# EAGLE design tripleir (EAGLE 6.6.0)
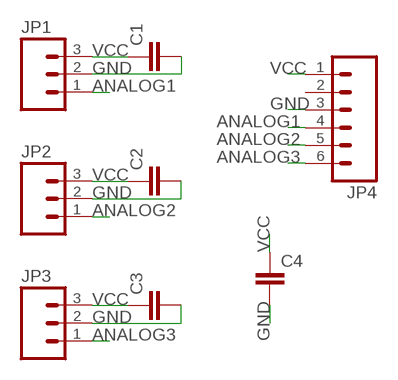
[diagram p0: schematic, sheet 1]

## Parts
C1  CAP0603-CAP  [0603-CAP]
C2  CAP0603-CAP  [0603-CAP]
C3  CAP0603-CAP  [0603-CAP]
C4  CAP0603-CAP  [0603-CAP]
JP1  M03LONGPADS  [1X03_LONGPADS]
JP2  M03LONGPADS  [1X03_LONGPADS]
JP3  M03LONGPADS  [1X03_LONGPADS]
JP4  M06SIP  [1X06]

## Nets
ANALOG1: JP1.1 JP4.4
ANALOG2: JP2.1 JP4.5
ANALOG3: JP3.1 JP4.6
GND: C1.2 C2.2 C3.2 C4.2 JP1.2 JP2.2 JP3.2 JP4.3
VCC: C1.1 C2.1 C3.1 C4.1 JP1.3 JP2.3 JP3.3 JP4.1
Unconnected: JP4.2

## Library data of the parts
C1-C4 = SparkFun-Capacitors:CAP: Capacitor Standard 0603 ceramic capacitor, and 0.1" leaded capacitor.
JP1-JP3 = SparkFun-Connectors:M03: Header 3 Standard 3-pin 0.1" header. Use with straight break away headers (SKU : PRT-00116), right angle break away headers (PRT-00553), swiss pins (PRT-00743), machine pins (PRT-00117), and female headers (PRT-00115). Molex polarized connector foot print use with SKU : PRT-08232 with associated crimp pins and housings.
JP4 = SparkFun-Connectors:M06: Header 6 Standard 6-pin 0.1" header. Use with straight break away headers (SKU : PRT-00116), right angle break away headers (PRT-00553), swiss pins (PRT-00743), machine pins (PRT-00117), and female headers (PRT-00115). Molex polarized connector foot print use with SKU : PRT-08094 with associated crimp pins and housings. NOTES ON THE VARIANTS LOCK and LOCK_LONGPADS... This footprint was designed to help hold the alignment of a through-hole component (i.e. 6-pin header) while soldering it into place. You may notice that each hole has been shifted either up or down by 0.005 of an inch from it's more standard position (which is a perfectly straight line). This slight alteration caused the pins (the squares in the middle) to touch the edges of the holes. Because they are alternating, it causes a "brace" to hold the component in place. 0.005 has proven to be the perfect amount of "off-center" position when using our standard breakaway headers. Although looks a little odd when you look at the bare footprint, once you have a header in there, the alteration is very hard to notice. Also,if you push a header all the way into place, it is covered up entirely on the bottom side. This idea of altering the position of holes to aid alignment will be further integrated into the Sparkfun Library for other footprints. It can help hold any component with 3 or more connection pins.

## Board
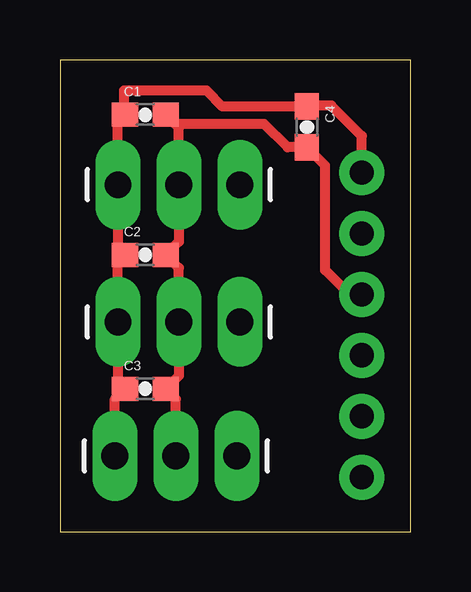
[diagram p1: board, top side]
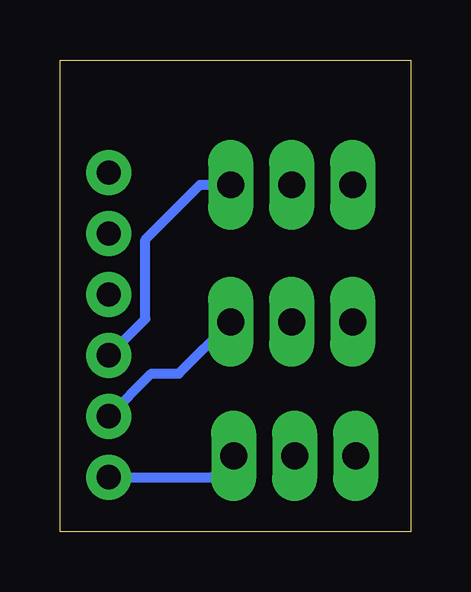
[diagram p2: board, bottom side, seen from below]

Size 14.61 x 19.68 mm. Coordinates in mm from the lower left corner, seen from the top.
Outline: 0,0 14.61,0 14.61,19.68 0,19.68 0,0
Copper layers (1*16): Top 0.035mm / dielectric 1.5mm / Bottom 0.035mm
Design rules "default": minimum track width 10mil, minimum drill 24mil, track to track 8mil, track to pad 8mil, pad to pad 8mil, via to via 8mil, smd to smd 8mil, copper to edge 40mil, drill to drill 8mil, minimum pad ring 10mil, minimum via ring 8mil, stop-mask expansion 4mil, vias tented up to drill 0mil, thermal gap 10mil

### Footprints (pad centres in the part's own frame; a part is rotated, then mirrored left to right if it is on the bottom)
0603-CAP = smd 1.1 x 1: 1 -0.85,0; 2 0.85,0
1X03_LONGPADS = drill 1.118 pad 1.88 long: 1 0,0; 2 2.54,0; 3 5.08,0
1X06 = drill 1.016 pad 1.88: 1 0,0; 2 2.54,0; 3 5.08,0; 4 7.62,0; 5 10.16,0; 6 12.7,0

### Placement (x,y rotation side)
C1  3.56,17.4 0 top
C2  3.56,11.56 0 top
C3  3.56,5.97 0 top
C4  10.29,16.89 270 top
JP1  7.49,14.48 180 top
JP2  7.49,8.76 180 top
JP3  7.37,3.17 180 top
JP4  12.57,14.99 270 top

### Tracks (layer width: path | path; a pad name or v marks a point on that pad's centre or on a via)
ANALOG1
  Bottom 0.406: JP4.4 11.05,8.89 11.05,12.19 8.76,14.48 JP1.1
ANALOG2
  Bottom 0.406: JP4.5 10.79,6.6 9.65,6.6 JP2.1
ANALOG3
  Bottom 0.406: JP4.6 8.26,2.29 JP3.1
GND
  Top 0.406: JP4.3 12.06,9.91 11.05,10.92 11.05,15.28 C4.2 9.49,16.04 8.51,17.02 4.79,17.02 C1.2 4.95,16.85 JP1.2 4.95,12.1 C2.2 4.95,11.01 JP2.2 4.95,6.52 C3.2 4.83,5.55 JP3.2
VCC
  Top 0.406: JP4.1 12.57,16.51 11.3,17.78 10.33,17.78 C4.1 6.77,17.74 6.1,18.41 2.67,18.41 2.67,17.44 C1.1 2.41,17.11 JP1.3 2.41,11.85 C2.1 2.41,11.26 JP2.3 2.41,6.26 C3.1 2.29,5.55 JP3.3